# Altium schematic sheet Connector.SchDoc
size A4; SheetNumber: 3; SheetTotal: 3
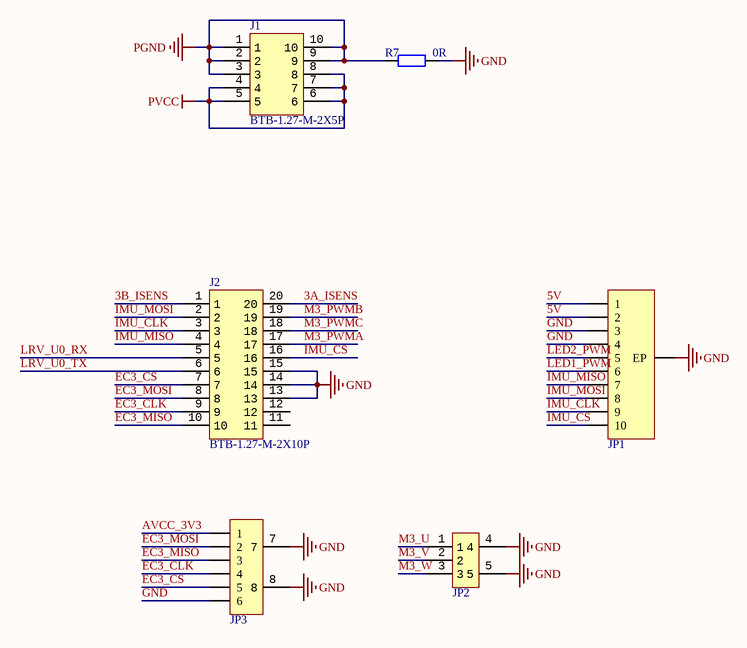
[diagram p0: Connector.SchDoc]

## Parts
J1  BTB-1.27-M-2X5P  [1.27-M-2X5P]
J2  BTB-1.27-M-2X10P  [1.27-M-2X10P]
JP1  FPC1.0-10P  [FPC0.5 1H-WS-10P]  (value not drawn)
JP2  HDR-1X3  [GH 1.25-LS-3P]  (value not drawn)
JP3  HDR-1X6  [GH1.25-LS-6P]  (value not drawn)
R7  0R  [R 1206_L]

## Nets
GND: J2.13 J2.14 J2.15 JP1.0(EP) JP1.3 JP1.4 JP2.4 JP2.5 JP3.6 JP3.7 JP3.8 R7.2
PGND: J1.1 J1.2 J1.3 J1.9 J1.10 R7.1
PVCC: J1.4 J1.5 J1.6 J1.7 J1.8
3A_ISENS: J2.20
3B_ISENS: J2.1
5V: JP1.1 JP1.2
AVCC_3V3: JP3.1
EC3_CLK: J2.9 JP3.4
EC3_CS: J2.7 JP3.5
EC3_MISO: J2.10 JP3.3
EC3_MOSI: J2.8 JP3.2
IMU_CLK: J2.3 JP1.9
IMU_CS: J2.16 JP1.10
IMU_MISO: J2.4 JP1.7
IMU_MOSI: J2.2 JP1.8
LED1_PWM: JP1.6
LED2_PWM: JP1.5
LRV_U0_RX: J2.5
LRV_U0_TX: J2.6
M3_PWMA: J2.17
M3_PWMB: J2.19
M3_PWMC: J2.18
M3_U: JP2.1
M3_V: JP2.2
M3_W: JP2.3

Not connected (* = marked no-connect by the designer): J2 11 12

## Library data of the parts
J1 = M-2X5P
J2 = M-2X10P
JP1 = FPC-10P: FPC连接器; 版权归属: 源创客; BOM名称: FPC连接器; 学习资源: www.ooocke.com
JP2 = Header 3: 3P接插件; 版权归属: 源创客; BOM名称: 3P接插件; 学习资源: www.ooocke.com
JP3 = Header 6: 6P接插件; 版权归属: 源创客; BOM名称: 6P接插件; 学习资源: www.ooocke.com
R7 = R: 贴片电阻; 版权归属: 源创客; BOM名称: 贴片电阻; 学习资源: www.ooocke.com